# EAGLE design Processing_bit (EAGLE 9.5.2)
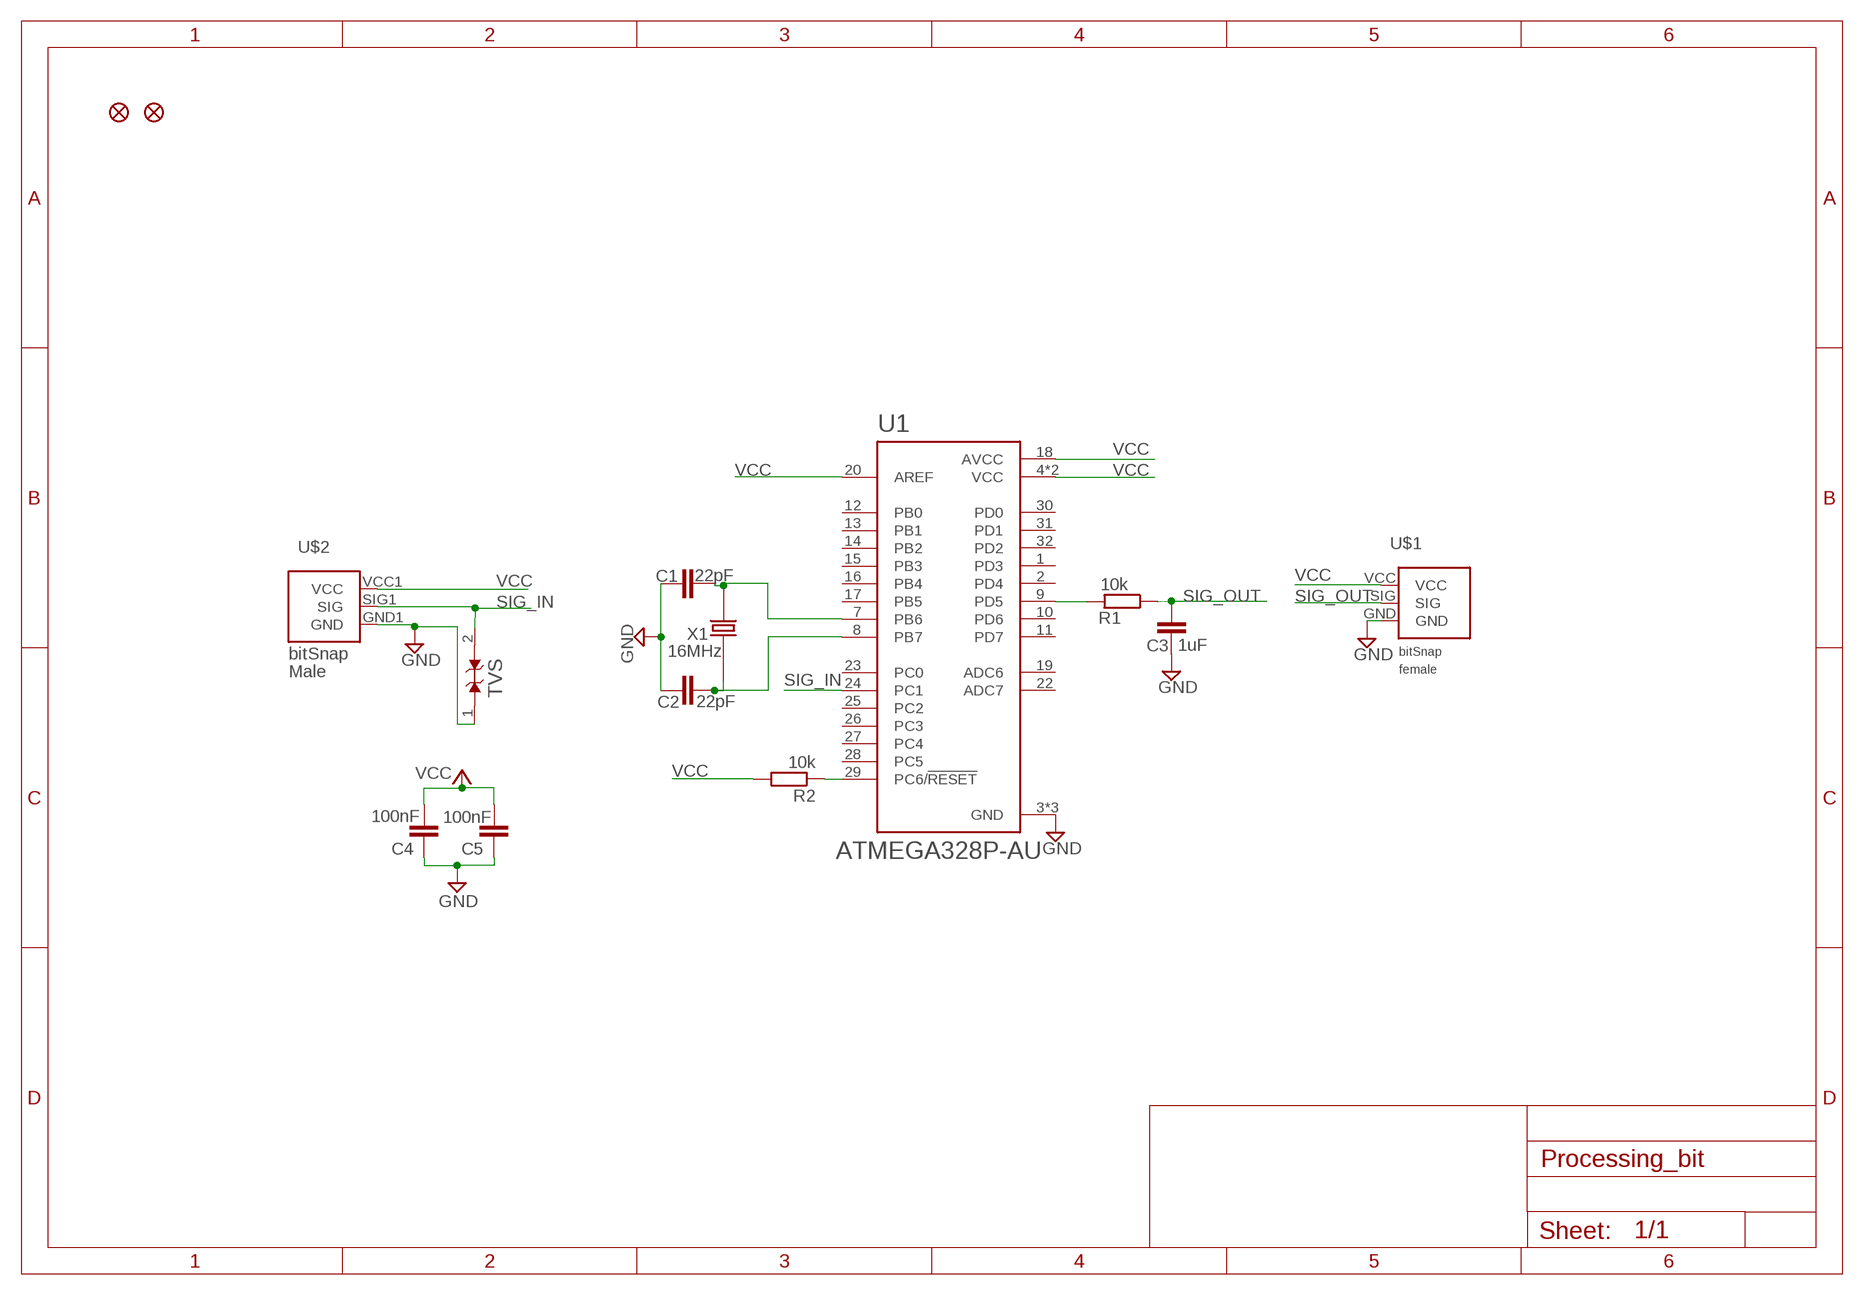
[diagram p0: schematic, sheet 1]

## Parts
C1  22pF  C-EUC0805  [C0805]
C2  22pF  C-EUC0805  [C0805]
C3  1uF  C-EUC0805  [C0805]
C4  100nF  C-EUC0805  [C0805]
C5  100nF  C-EUC0805  [C0805]
R1  10k  R-EU_R0805  [R0805]
R2  10k  R-EU_R0805  [R0805]
TVS  ESD9B5.0ST5G  [SODFL1006X40N]
U1  ATMEGA328P-AU  [QFP80P900X900X120-32N]
U$1  BITSNAP_V03_FEMALE  [BITSNAP_V03_FEMALE]
U$2  BITSNAP_V03_MALE  [BITSNAP_V03_MALE]
U$3  FIDUCIAL  [FIDUCIAL1X2.5]
U$4  FIDUCIAL  [FIDUCIAL1X2.5]
X1  16MHz  7A-24.000MAAJ-T  [XTAL500X320X120]

## Nets
GND: C1.1 C2.1 C3.1 C4.1 C5.1 TVS.1(A) U1.3(GND) U1.5(GND) U1.21(GND) U$1.GND U$2.GND1(GND)
N$1: C1.2 U1.7(PB6) X1.2
N$2: C2.2 U1.8(PB7) X1.1
N$3: R2.1 U1.29(PC6/!RESET)
N$5: R1.2 U1.9(PD5)
SIG_IN: TVS.2(A1) U1.24(PC1) U$2.SIG1(SIG)
SIG_OUT: C3.2 R1.1 U$1.SIG
VCC: C4.2 C5.2 R2.2 U1.4(VCC) U1.6(VCC) U1.18(AVCC) U1.20(AREF) U$1.VCC U$2.VCC1(VCC)
Unconnected: U1.1(PD3) U1.2(PD4) U1.10(PD6) U1.11(PD7) U1.12(PB0) U1.13(PB1) U1.14(PB2) U1.15(PB3) U1.16(PB4) U1.17(PB5) U1.19(ADC6) U1.22(ADC7) U1.23(PC0) U1.25(PC2) U1.26(PC3) U1.27(PC4) U1.28(PC5) U1.30(PD0) U1.31(PD1) U1.32(PD2)

## Library data of the parts
C1-C5 = rcl:C-EU: CAPACITOR, European symbol; SPICEPREFIX: C
R1 R2 = rcl:R-EU_: RESISTOR, European symbol; SPICEPREFIX: R
TVS = ESD9B5.0ST5G:ESD9B5.0ST5G: ESD9B Series 7.8 V 15 pF Surface Mount TVS Diode - SOD-923; AVAILABILITY: Unavailable; DESCRIPTION: Clamp Ipp Tvs Diode Surface Mount SOD-923; MF: ON Semiconductor; MP: ESD9B5.0ST5G; PACKAGE: SOD-923 ON Semiconductor; PRICE: None
U1 = ATMEGA328P-AU:ATMEGA328P-AU: ATmega Series 20 MHz 32 KB Flash 2 KB SRAM 8-Bit Microcontroller - TQFP-32; AVAILABILITY: Unavailable; DESCRIPTION: AVR AVR® ATmega Microcontroller IC 8-Bit 20MHz 32KB _16K x 16_ FLASH 32-TQFP _7x7_; MF: Microchip Technology; MP: ATMEGA328P-AU; PACKAGE: TQFP-32 Microchip Technology; PRICE: None
U$1 = bitSnap140813:BITSNAP_V03_FEMALE
U$2 = bitSnap140813:BITSNAP_V03_MALE
U$3 U$4 = LITTLEBITS140915:FIDUCIAL
X1 = 7A-24.000MAAJ-T:7A-24.000MAAJ-T: Crystal 24MHz 30ppm (Tol) 30ppm (Stability) 18pF FUND 50Ohm 2-Pin SMD T/R; AVAILABILITY: Unavailable; DESCRIPTION: 24MHz ±30ppm Crystal 18pF 50 Ohms 2-SMD, No Lead; MF: TXC; MP: 7A-24.000MAAJ-T; PACKAGE: SMD-2 TXC; PRICE: None

## Board
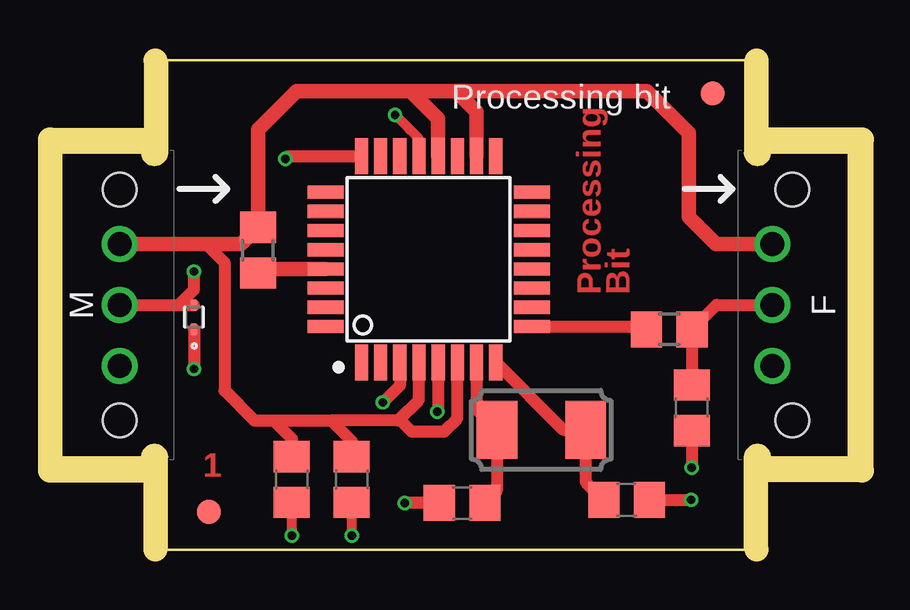
[diagram p1: board, top side]
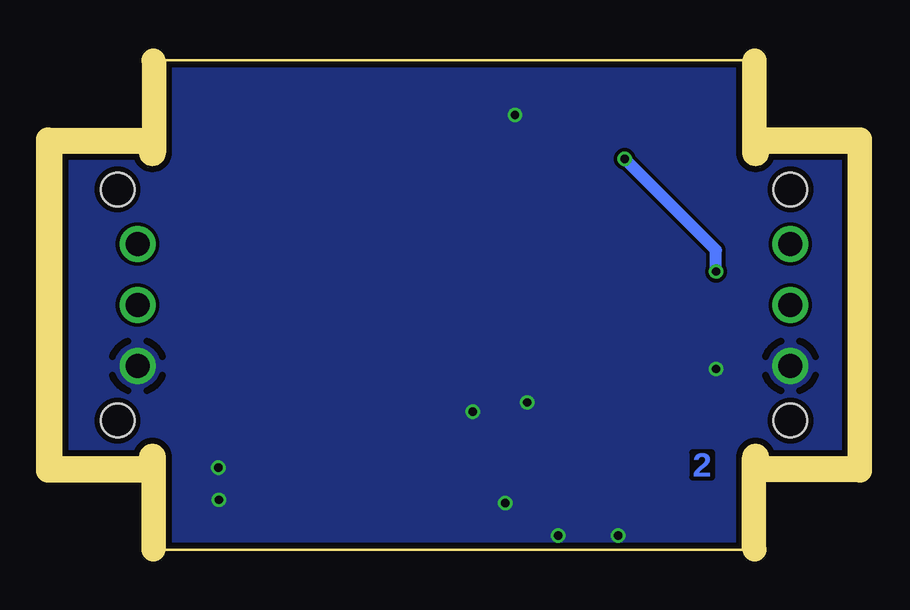
[diagram p2: board, bottom side, seen from below]

Size 32.94 x 20.44 mm. Coordinates in mm from the lower left corner, seen from the top.
Outline: 4.44,20.44 28.57,20.44 28.57,16.57 arc180 29.59,16.57 32.89,16.57 32.89,3.87 29.59,3.87 arc180 28.57,3.87 28.57,0 4.44,0 4.44,3.87 arc180 3.43,3.87 0,3.87 0,16.57 3.43,16.57 arc180 4.44,16.57 4.44,20.44
Copper layers (1*16): Top 0.018mm / dielectric 1.6mm / Bottom 0.018mm
Design rules "eC_2Layer_PClass6_BaseCopperO18_eCDefault *": minimum track width 0.15mm, minimum drill 0.35mm, track to track 0.15mm, track to pad 0.15mm, pad to pad 0.15mm, via to via 0.15mm, smd to smd 0mil, copper to edge 0.25mm, drill to drill 0.35mm, minimum pad ring 0.175mm, minimum via ring 0.125mm, stop-mask expansion 0mil, vias tented up to drill 0.45mm, thermal gap 0.2mm

### Footprints (pad centres in the part's own frame; a part is rotated, then mirrored left to right if it is on the bottom)
C0805 = smd 1.3 x 1.5: 1 -0.95,0; 2 0.95,0
R0805 = smd 1.3 x 1.5: 1 -0.95,0; 2 0.95,0
SODFL1006X40N = smd 0.5 x 0.3: 1 -0.5,0; 2 0.5,0
QFP80P900X900X120-32N = smd 1.5 x 0.55: 1 -4.3,2.8; 2 -4.3,2; 3 -4.3,1.2; 4 -4.3,0.4; 5 -4.3,-0.4; 6 -4.3,-1.2; 7 -4.3,-2; 8 -4.3,-2.8; 17 4.3,-2.8; 18 4.3,-2; 19 4.3,-1.2; 20 4.3,-0.4; 21 4.3,0.4; 22 4.3,1.2; 23 4.3,2; 24 4.3,2.8 | smd 0.55 x 1.5: 9 -2.8,-4.3; 10 -2,-4.3; 11 -1.2,-4.3; 12 -0.4,-4.3; 13 0.4,-4.3; 14 1.2,-4.3; 15 2,-4.3; 16 2.8,-4.3; 25 2.8,4.3; 26 2,4.3; 27 1.2,4.3; 28 0.4,4.3; 29 -0.4,4.3; 30 -1.2,4.3; 31 -2,4.3; 32 -2.8,4.3
BITSNAP_V03_FEMALE = drill 1: GND 4.065,3.44; SIG 6.605,3.44; VCC 9.145,3.44 | hole 1.4: 1.785,2.61; 11.425,2.61
BITSNAP_V03_MALE = drill 1: GND1 9.145,2.61; SIG1 6.605,2.61; VCC1 4.065,2.61 | hole 1.4: 1.785,2.61; 11.425,2.61
FIDUCIAL1X2.5 = smd 1 x 1: 1 0,0
XTAL500X320X120 = smd 1.7 x 2.4: 1 -1.85,0; 2 1.85,0

### Placement (x,y rotation side)
C1  16.76,1.96 0 top
C2  23.62,2.09 180 top
C3  26.34,5.93 90 top
C4  9.66,2.94 90 top
C5  12.16,2.94 90 top
R1  25.4,9.2 180 top
R2  8.25,12.5 90 top
TVS  5.59,9.71 90 top
U1  15.37,12.12 90 top
U$1  33.15,3.61 90 top
U$2  -0.13,16.82 270 top
U$3  6.21,1.59 0 top
U$4  27.21,19.04 0 top
X1  20.07,5.01 180 top

### Tracks (layer width: path | path; a pad name or v marks a point on that pad's centre or on a via)
GND  (via drill 0.35)
  Top 0.406: v13.97,18.15 14.59,17.53 14.97,17.15 U1.21 | C4.1 v9.66,0.6 | C5.1 v12.16,0.6
  Top 0.508: C1.1 v14.37,1.96 14.34,1.99 | 24.83,1.84 C2.1 v26.31,2.09 | U1.5 15.77,5.81 v15.73,5.77 | TVS.1 v5.59,7.55 | U1.3 14.17,6.86 v13.46,6.15 | C3.1 v26.34,3.44
  pour Bottom (no thermals): -1.29,21.54 35.31,21.54 35.31,-1.66 -1.29,-1.66
N$1
  Top 0.508: U1.7 17.37,5.86 X1.2 18.22,2.46 C1.2
N$2
  Top 0.508: U1.8 20.98,5.01 X1.1 21.92,2.85 C2.2
N$3
  Top 0.61: U1.29 8.42,11.72 R2.1
N$5
  Top 0.508: U1.9 24.33,9.32 R1.2
SIG_IN  (via drill 0.35)
  Top 0.508: v5.59,11.62 5.59,10.85 4.95,10.22 | U$2.SIG1 4.95,10.22 | 4.95,10.22 4.96,10.21 TVS.2 | v9.4,16.31 9.51,16.42 U1.24
  Bottom 0.508: v5.59,11.62 5.59,12.5 v9.4,16.31
SIG_OUT
  Top 0.508: C3.2 26.35,6.89 R1.1 27.37,10.22 U$1.SIG
VCC
  Top 0.508: 8.91,5.4 8.1,5.4 6.86,6.64 6.86,11.99 6.1,12.76 6.06,12.76 | 8.91,5.4 11.31,5.4 | 14.1,5.4 11.31,5.4 | 14.1,5.4 14.97,6.26 U1.4 | 14.1,5.4 14.2,5.4 14.66,4.94 16.01,4.94 16.57,5.5 U1.6 | 8.91,5.4 9.66,4.65 C4.2 | 11.31,5.4 12.16,4.55 C5.2
  Top 0.61: U$2.VCC1 6.06,12.76 7.56,12.76 R2.2 8.25,17.54 9.86,19.14 14.61,19.14 | 14.61,19.14 16.51,19.14 | 16.51,19.14 24.46,19.14 26.21,17.39 26.21,13.89 27.34,12.76 U$1.VCC | 14.61,19.14 15.77,17.99 U1.20 | 16.51,19.14 17.37,18.29 U1.18

### Text on the board
Top: Processing | Bit | 1
Bottom: 2
tPlace: Processing bit